# EAGLE design ONE BOARD OUTPUT (EAGLE 8.7.1)
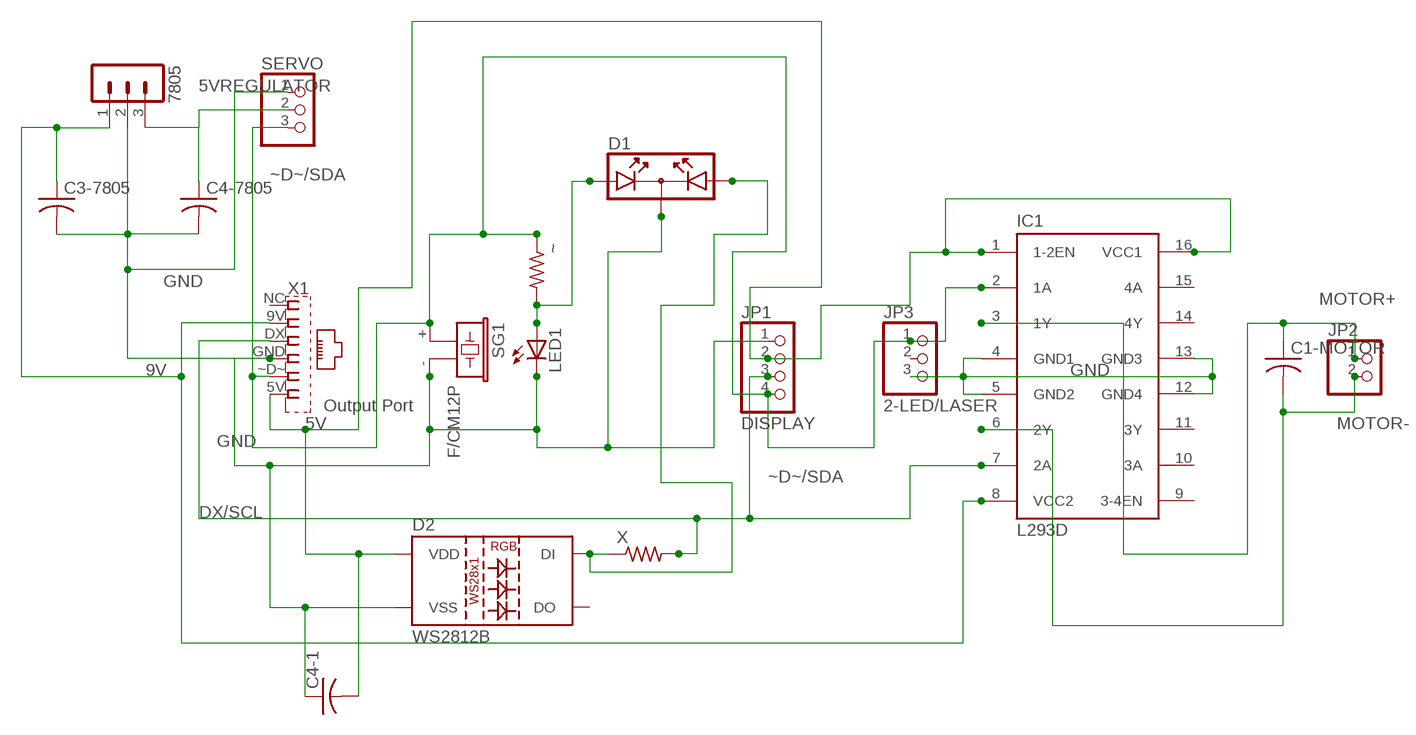
[diagram p0: schematic, sheet 1]

## Parts
7805  MA03-1  [MA03-1]
C1-MOTOR  C-US025-030X050  [C025-030X050]
C3-7805  C-US025-030X050  [C025-030X050]
C4-1  C-US025-030X050  [C025-030X050]
C4-7805  C-US025-030X050  [C025-030X050]
D1  DUOLED  [DUOLED]
D2  WS2812B  [WS2812B]
IC1  L293D  [DIL16]
JP1  DISPLAY  PINHD-1X4  [1X04]
JP2  PINHD-1X2  [1X02]
JP3  2-LED/LASER  PINHD-1X3  [1X03]
LED1  LED10MM  [LED10MM]
SERVO  PINHD-1X3  [1X03]
SG1  F/CM12P  [F/CM12P]
X  R-US_0207/10  [0207/10]
X1  Output Port  ELEMENTORY-RJ11OUTPUT-DEVICE  [ELEMENTORY-OUT-SEN]
~  R-US_0207/10  [0207/10]

## Nets
5V: C4-1.2 D2.1(VDD) IC1.1(1-2EN) IC1.16(VCC1) JP1.2 X1.5V
5VREGULATOR: 7805.3 C4-7805.1 SERVO.2
9V: 7805.1 C3-7805.1 IC1.8(VCC2) X1.9V
DX/SCL: IC1.7(2A) JP1.3 X1.DX X.2
GND: 7805.2 C3-7805.2 C4-1.1 C4-7805.2 D1.K D2.3(VSS) IC1.4(GND1) IC1.5(GND2) IC1.12(GND4) IC1.13(GND3) JP1.1 JP3.3 LED1.K(C) SERVO.1 SG1.- X1.GND
LED_SIG: D1.A1 LED1.A ~.2
MOTOR+: C1-MOTOR.1 IC1.3(1Y) JP2.1
MOTOR-: C1-MOTOR.2 IC1.6(2Y) JP2.2
N$2: D1.A2 D2.4(DI) X.1
~D~/SDA: IC1.2(1A) JP1.4 JP3.1 SERVO.3 SG1.+ X1.~D~ ~.1
Unconnected: D2.2(DO) IC1.9(3-4EN) IC1.10(3A) IC1.11(3Y) IC1.14(4Y) IC1.15(4A) JP3.2 X1.NC

## Library data of the parts
7805 = con-lstb:MA03-1: PIN HEADER; OC_FARNELL: unknown; OC_NEWARK: unknown
C1-MOTOR C3-7805 C4-1 C4-7805 = adafruit:C-US: CAPACITOR, American symbol
D1 = special:DUOLED: Duo LED
D2 = SparkFun-LED:WS2812B: WS2812B SMD addressable RGB LED 5x5mm SMD LED with built-in controller IC. Color: Red/Green/Blue mC Rating: RGB: 390, 660, 180 mcd Forward Voltage: RGB: 2.0, 3.0, 3.0 V Packages:WS2812B SparkFun Products: Blynk Board - ESP8266 <https://www.sparkfun.com/products/13794>; PROD_ID: DIO-12503
IC1 = st-microelectronics:L293D: PUSH-PULL 4 CHANNEL DRIVER; MPN: L293D; OC_FARNELL: 9589619; OC_NEWARK: 56P8249
JP1 = pinhead:PINHD-1X4: PIN HEADER
JP2 = pinhead:PINHD-1X2: PIN HEADER
JP3 SERVO = adafruit:PINHD-1X3: PIN HEADER
LED1 = led:LED: LED OSRAM: - CHIPLED LG R971, LG N971, LY N971, LG Q971, LY Q971, LO R971, LY R971 LH N974, LH R974 LS Q976, LO Q976, LY Q976 LO Q996 - Hyper CHIPLED LW Q18S LB Q993, LB Q99A, LB R99A - SideLED LS A670, LO A670, LY A670, LG A670, LP A670 LB A673, LV A673, LT A673, LW A673 LH A674 LY A675 LS A676, LA A676, LO A676, LY A676, LW A676 LS A679, LY A679, LG A679 - Hyper Micro SIDELED® LS Y876, LA Y876, LO Y876, LY Y876 LT Y87S - SmartLED LW L88C, LW L88S LB L89C, LB L89S, LG L890 LS L89K, LO L89K, LY L89K LS L896, LA L896, LO L896, LY L896 - TOPLED LS T670, LO T670, LY T670, LG T670, LP T670 LSG T670, LSP T670, LSY T670, LOP T670, LYG T670 LG T671, LOG T671, LSG T671 LB T673, LV T673, LT T673, LW T673 LH T674 LS T676, LA T676, LO T676, LY T676, LB T676, LH T676, LSB T676, LW T676 LB T67C, LV T67C, LT T67C, LS T67K, LO T67K, LY T67K, LW E67C LS E67B, LA E67B, LO E67B, LY E67B, LB E67C, LV E67C, LT E67C LW T67C LS T679, LY T679, LG T679 LS T770, LO T770, LY T770, LG T770, LP T770 LB T773, LV T773, LT T773, LW T773 LH T774 LS E675, LA E675, LY E675, LS T675 LS T776, LA T776, LO T776, LY T776, LB T776 LHGB T686 LT T68C, LB T68C - Hyper Mini TOPLED® LB M676 - Mini TOPLED Santana® LG M470 LS M47K, LO M47K, LY M47K Source: http://www.osram.convergy.de LUXEON: - LUMILED® LXK2-PW12-R00, LXK2-PW12-S00, LXK2-PW14-U00, LXK2-PW14-V00 LXK2-PM12-R00, LXK2-PM12-S00, LXK2-PM14-U00 LXK2-PE12-Q00, LXK2-PE12-R00, LXK2-PE12-S00, LXK2-PE14-T00, LXK2-PE14-U00 LXK2-PB12-K00, LXK2-PB12-L00, LXK2-PB12-M00, LXK2-PB14-N00, LXK2-PB14-P00, LXK2-PB14-Q00 LXK2-PR12-L00, LXK2-PR12-M00, LXK2-PR14-Q00, LXK2-PR14-R00 LXK2-PD12-Q00, LXK2-PD12-R00, LXK2-PD12-S00 LXK2-PH12-R00, LXK2-PH12-S00 LXK2-PL12-P00, LXK2-PL12-Q00, LXK2-PL12-R00 Source: www.luxeon.com KINGBRIGHT: KA-3528ASYC Source: www.kingbright.com
SG1 = buzzer:F/CM12P: BUZZER Source: Buerklin; OC_FARNELL: unknown; OC_NEWARK: unknown
X ~ = adafruit:R-US_: RESISTOR, American symbol
X1 = ELEMENTORY-RJ11-V1.0:ELEMENTORY-RJ11: RJ11 6 connects Source: YH-55-10.pdf

## Board
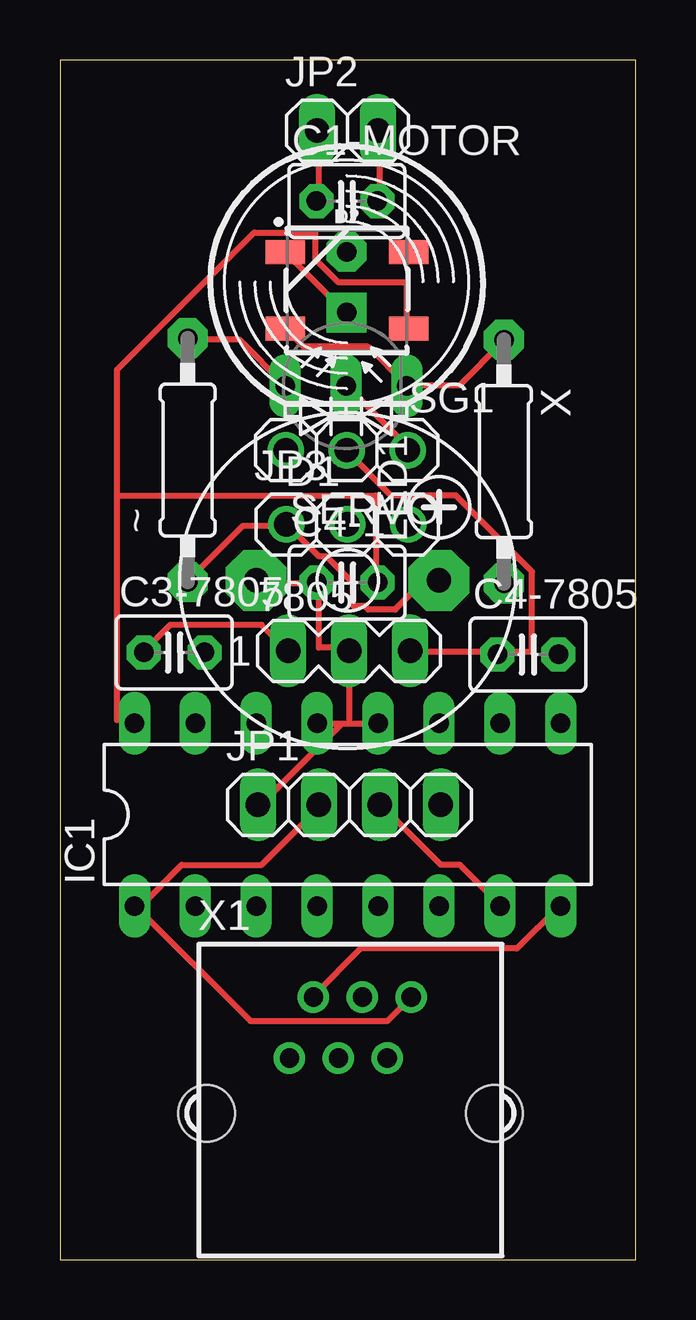
[diagram p1: board, top side]
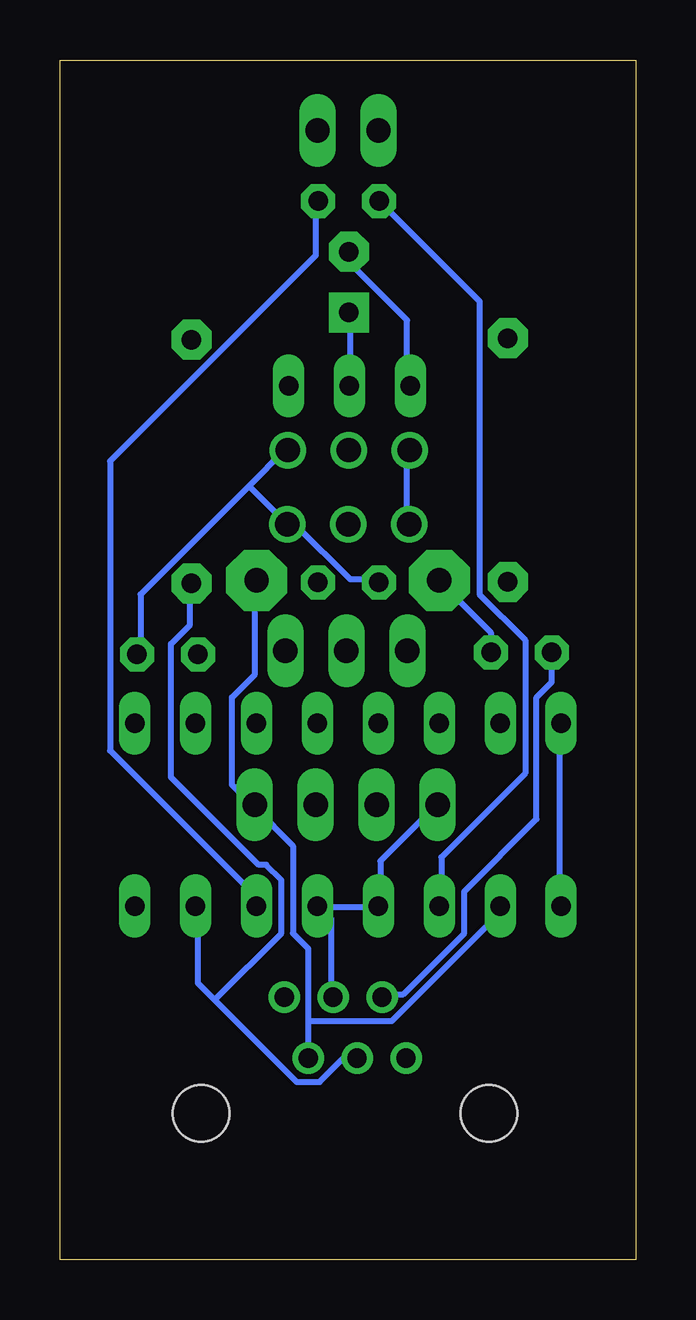
[diagram p2: board, bottom side, seen from below]

Size 24 x 50 mm. Coordinates in mm from the lower left corner, seen from the top.
Outline: 0,0 24,0 24,50 0,50 0,0
Copper layers (1*16): Top 0.035mm / dielectric 1.5mm / Bottom 0.035mm
Design rules "default *": minimum track width 10mil, minimum drill 0.3mm, track to track 7mil, track to pad 7mil, pad to pad 7mil, via to via 7mil, smd to smd 6mil, copper to edge 10mil, drill to drill 6mil, minimum pad ring 10mil, minimum via ring 8mil, stop-mask expansion 4mil, vias tented up to drill 0mil, thermal gap 10mil

### Footprints (pad centres in the part's own frame; a part is rotated, then mirrored left to right if it is on the bottom)
MA03-1 = drill 1.016 long: 1 -2.54,0; 2 0,0; 3 2.54,0
C025-030X050 = drill 0.813 pad 1.422 octagon: 1 -1.27,0; 2 1.27,0
DUOLED = drill 0.813 long: A1 -3.81,0; A2 1.27,0; K -1.27,0
WS2812B = smd 1.651 x 1: 1 2.577,-1.6; 2 2.577,1.6; 3 -2.577,1.6; 4 -2.577,-1.6
DIL16 = drill 0.813 long: 1 -8.89,-3.81; 2 -6.35,-3.81; 3 -3.81,-3.81; 4 -1.27,-3.81; 5 1.27,-3.81; 6 3.81,-3.81; 7 6.35,-3.81; 8 8.89,-3.81; 9 8.89,3.81; 10 6.35,3.81; 11 3.81,3.81; 12 1.27,3.81; 13 -1.27,3.81; 14 -3.81,3.81; 15 -6.35,3.81; 16 -8.89,3.81
1X04 = drill 1.016 long: 1 -3.81,0; 2 -1.27,0; 3 1.27,0; 4 3.81,0
1X02 = drill 1.016 long: 1 -1.27,0; 2 1.27,0
1X03 = drill 1.016: 1 -2.54,0; 2 0,0; 3 2.54,0
LED10MM = drill 0.813 pad 1.676 octagon: A -1.27,0 | drill 0.813 pad 1.676 square: K 1.27,0
F/CM12P = drill 1.016 pad 2.54 octagon: + 3.81,0; - -3.81,0
0207/10 = drill 0.813 pad 1.676 octagon: 1 -5.08,0; 2 5.08,0
ELEMENTORY-OUT-SEN = drill 0.8 pad 1.3: 5V 2.54,4.84; 9V -1.54,4.84; DX -0.5,2.3; GND 0.5,4.84; NC -2.54,2.3; ~D~ 1.54,2.3 | hole 2.36: -6,0; 6,0

### Placement (x,y rotation side)
7805  12.06,25.37 0 top
C1-MOTOR  11.96,44.12 0 top
C3-7805  4.76,25.31 0 top
C4-1  11.97,28.22 0 top
C4-7805  19.51,25.22 0 top
D1  13.2,36.42 0 top
D2  11.97,40.39 0 top
IC1  11.99,18.55 0 top
JP1  12.07,18.96 0 top
JP2  11.99,47.06 0 top
JP3  11.98,30.64 0 top
LED1  11.95,40.74 270 top
SERVO  11.96,33.74 180 top
SG1  11.99,28.31 0 top
X  18.51,33.26 270 top
X1  12.11,6.1 0 top
~  5.33,33.33 90 top

### Tracks (layer width: path | path; a pad name or v marks a point on that pad's centre or on a via)
5V
  Top 0.254: X1.5V 14.61,10.9 13.65,9.94 7.94,9.94 3.17,14.71 IC1.1 3.33,14.71 5.08,16.45 8.41,16.45 10.79,18.83 JP1.2 | 2.38,31.85 2.38,22.48 3.02,22.48 IC1.16 | 2.38,31.85 2.38,37.09 8.1,42.81 10.64,42.81 10.64,41.69 11.59,40.74 14.45,40.74 14.45,38.84 D2.1 | 2.38,31.85 13.18,31.85 13.18,28.36 C4-1.2
  Bottom 0.254: IC1.1 3.17,14.87 3.17,22.33 IC1.16
5VREGULATOR
  Top 0.254: 7805.3 14.61,25.34 18.1,25.34 C4-7805.1 18.26,25.34 19.68,25.34 19.68,28.68 16.51,31.85 13.81,31.85 12.06,33.6 SERVO.2
9V
  Top 0.254: C3-7805.1 3.49,25.34 4.6,26.45 8.41,26.45 9.37,25.5 7805.1 | X1.9V 10.64,11.05 12.54,12.96 19.05,12.96 20.8,14.71 IC1.8
  Bottom 0.254: C3-7805.1 3.49,25.18 3.49,24.07 4.13,23.44 4.13,18.36 7.14,15.34 7.14,13.59 9.68,11.05 10.48,11.05 X1.9V
DX/SCL
  Top 0.254: JP1.3 13.49,18.83 15.88,16.45 16.67,16.45 18.26,14.87 IC1.7
  Bottom 0.254: 17.54,10.82 18.26,11.53 18.26,14.71 IC1.7 | 17.54,10.82 14.13,7.4 13.18,7.4 12.22,8.36 11.75,8.36 X1.DX | 17.54,10.82 14.76,13.59 14.76,15.82 15.4,16.45 15.72,16.45 19.37,20.1 19.37,25.66 18.57,26.45 18.57,28.04 X.2
GND
  Top 0.254: SG1.- 8.26,28.2 10.64,28.2 C4-1.1 10.79,28.2 10.79,25.5 11.91,25.5 7805.2 12.06,25.34 12.06,22.33 | 12.06,22.33 13.18,22.33 IC1.12 | 12.06,22.33 11.75,22.33 | 11.75,22.33 10.79,22.33 IC1.13 | 11.75,22.33 8.41,18.99 JP1.1 | D2.3 9.53,41.85 11.91,39.47 LED1.K | D1.K 12.06,36.3 14.61,33.76 SERVO.1
  Bottom 0.254: C3-7805.2 6.03,25.34 6.03,26.14 8.1,28.2 SG1.- | X1.GND 12.7,11.05 12.7,14.23 13.18,14.71 IC1.5 13.02,14.71 10.79,14.71 IC1.4 10.64,14.87 10.64,16.61 8.41,18.83 JP1.1 | D1.K 11.91,36.45 11.91,39.31 LED1.K | 16.11,32.25 14.61,33.76 SERVO.1 | 16.11,32.25 20.64,27.72 20.64,25.34 C4-7805.2 | 16.11,32.25 14.61,30.74 JP3.3 14.45,30.58 14.13,30.58 11.91,28.36 10.79,28.36 C4-1.1
LED_SIG
  Top 0.254: D1.A1 9.37,36.45 7.46,38.36 5.4,38.36 ~.2
  Bottom 0.254: LED1.A 11.91,41.85 11.91,41.53 9.53,39.15 9.53,36.45 D1.A1
MOTOR+
  Top 0.254: JP2.1 10.79,46.93 10.79,44.23 C1-MOTOR.1
  Bottom 0.254: IC1.3 8.1,14.87 8.1,16.77 4.6,20.26 4.6,25.82 6.51,27.72 6.51,39.95 10.64,44.08 C1-MOTOR.1
MOTOR-
  Top 0.254: JP2.2 13.34,46.93 13.34,44.23 C1-MOTOR.2
  Bottom 0.254: IC1.6 15.88,14.87 15.88,15.18 21.91,21.22 21.91,33.28 13.34,41.85 13.34,44.08 C1-MOTOR.2
N$2
  Top 0.254: D2.4 9.53,38.68 10.16,38.04 12.86,38.04 14.45,36.45 D1.A2 14.61,36.45 16.67,36.45 18.41,38.2 X.1
~D~/SDA
  Top 0.254: ~.1 5.4,28.36 7.62,30.58 9.37,30.58 JP3.1 9.53,30.58 10.79,29.31 11.11,29.31 12.22,28.2 12.22,27.25 12.7,27.25 12.86,27.09 13.97,27.09 15.08,28.2 15.72,28.2 SG1.+
  Bottom 0.254: SERVO.3 9.53,33.6 9.53,30.74 JP3.1 | 13.65,9.94 13.65,12.96 14.29,13.59 14.29,17.25 15.88,18.83 JP1.4 16.03,18.99 16.83,19.79 16.83,23.44 15.88,24.39 15.88,28.2 SG1.+ | 13.65,9.94 13.65,8.52 X1.~D~ | 13.65,9.94 10.16,9.94 5.71,14.39 5.71,14.71 IC1.2

### Text on the board
200bmp: ONE BOARD OUTPUT | ELEMENTORY.IN